# Altium schematic sheet blm_ctrl_processor.SchDoc
size A4; DrawnBy: mcattin; Organization: E-ROBOT
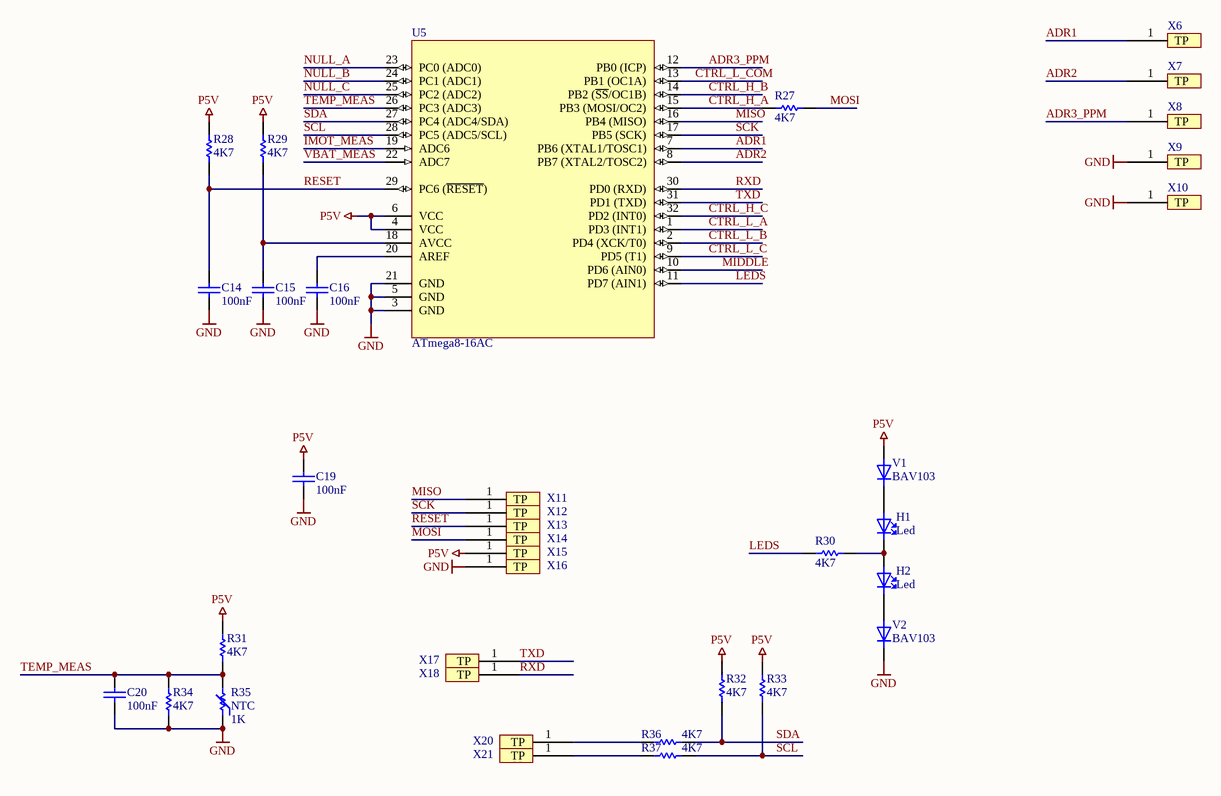
[diagram p0: blm_ctrl_processor.SchDoc]

## Parts
C14  value 100nF  [0603]  (hidden comment: Cap)
C15  value 100nF  [0603]  (hidden comment: Cap)
C16  value 100nF  [0603]  (hidden comment: Cap)
C19  value 100nF  [0603]  (hidden comment: Cap)
C20  value 100nF  [0603]  (hidden comment: Cap)
H1  Led  [0603_LED]
H2  Led  [0603_LED]
R27  value 4K7  [0603]  (hidden comment: Res1)
R28  value 4K7  [0603]  (hidden comment: Res1)
R29  value 4K7  [0603]  (hidden comment: Res1)
R30  value 4K7  [0603]  (hidden comment: Res1)
R31  value 4K7  [0603]  (hidden comment: Res1)
R32  value 4K7  [0603]  (hidden comment: Res1)
R33  value 4K7  [0603]  (hidden comment: Res1)
R34  value 4K7  [0603]  (hidden comment: Res1)
R35  NTC  value 1K  [0603]
R36  value 4K7  [0603]  (hidden comment: Res1)
R37  value 4K7  [0603]  (hidden comment: Res1)
U5  ATmega8-16AC  [32A_L]
V1  value BAV103  [0603_LED]  (hidden comment: Diode)
V2  value BAV103  [0603_LED]  (hidden comment: Diode)
X6  (no value)  [PAD_SMD_0.5x1MM]
X7  (no value)  [PAD_SMD_0.5x1MM]
X8  (no value)  [PAD_SMD_0.5x1MM]
X9  (no value)  [PAD_SMD_0.5x1MM]
X10  (no value)  [PAD_SMD_0.5x1MM]
X11  (no value)  [PAD_SMD_1.5x2.5MM]
X12  (no value)  [PAD_SMD_1.5x2.5MM]
X13  (no value)  [PAD_SMD_1.5x2.5MM]
X14  (no value)  [PAD_SMD_1.5x2.5MM]
X15  (no value)  [PAD_SMD_1.5x2.5MM]
X16  (no value)  [PAD_SMD_1.5x2.5MM]
X17  (no value)  [PAD_SMD_1x2MM]
X18  (no value)  [PAD_SMD_1x2MM]
X20  (no value)  [PAD_SMD_1x2MM]
X21  (no value)  [PAD_SMD_1x2MM]

## Nets
GND: C14.2 C15.2 C16.2 C19.2 C20.2 R34.2 R35.2 U5.3(GND) U5.5(GND) U5.21(GND) V2.2(CATHODE) X9.1(TP) X10.1(TP) X16.1(TP)
P5V: C19.1 R28.1 R29.1 R31.1 R32.1 R33.1 U5.4(VCC) U5.6(VCC) V1.1(ANODE) X15.1(TP)
ADR1: U5.7(PB6_(XTAL1/TOSC1)) X6.1(TP)
ADR2: U5.8(PB7_(XTAL2/TOSC2)) X7.1(TP)
ADR3_PPM: U5.12(PB0_(ICP)) X8.1(TP)
CTRL_H_A: R27.2 U5.15(PB3_(MOSI/OC2))
CTRL_H_B: U5.14(PB2_(~{SS}/OC1B))
CTRL_H_C: U5.32(PD2_(INT0))
CTRL_L_A: U5.1(PD3_(INT1))
CTRL_L_B: U5.2(PD4_(XCK/T0))
CTRL_L_C: U5.9(PD5_(T1))
CTRL_L_COM: U5.13(PB1_(OC1A))
IMOT_MEAS: U5.19(ADC6)
LEDS: R30.1 U5.11(PD7_(AIN1))
MIDDLE: U5.10(PD6_(AIN0))
MISO: U5.16(PB4_(MISO)) X11.1(TP)
MOSI: R27.1 X14.1(TP)
NULL_A: U5.23(PC0_(ADC0))
NULL_B: U5.24(PC1_(ADC1))
NULL_C: U5.25(PC2_(ADC2))
RESET: C14.1 R28.2 U5.29(PC6_(~{RESET})) X13.1(TP)
RXD: U5.30(PD0_(RXD)) X18.1(TP)
SCK: U5.17(PB5_(SCK)) X12.1(TP)
SCL: R33.2 R37.1 U5.28(PC5_(ADC5/SCL))
SDA: R32.2 R36.1 U5.27(PC4_(ADC4/SDA))
TEMP_MEAS: C20.1 R31.2 R34.1 R35.1 U5.26(PC3_(ADC3))
TXD: U5.31(PD1_(TXD)) X17.1(TP)
VBAT_MEAS: U5.22(ADC7)
NetC15_1: C15.1 R29.2 U5.18(AVCC)
NetC16_1: C16.1 U5.20(AREF)
NetH1_1: H1.1(ANODE) V1.2(CATHODE)
NetH1_2: H1.2(CATHODE) H2.1(ANODE) R30.2
NetH2_2: H2.2(CATHODE) V2.1(ANODE)
NetR36_2: R36.2 X20.1(TP)
NetR37_2: R37.2 X21.1(TP)

## Notes on the sheet
- Title
- Size:
- Date:
- A3
- Number:
- Time:
- Revision:
- Sheet
- of
- Design:
- File:

## Library data of the parts
C14-C16 C19 C20 = Cap: Capacitor; Published: 8-Jun-2000; LatestRevisionDate: 17-Jul-2002; LatestRevisionNote: Re-released for DXP Platform.; PackageReference: RAD-0.3; Publisher: Altium Limited
H1 H2 = Led: Led low current; Fournisseur: *; Ref_fournisseur: *
R27-R34 R36 R37 = Res1: Resistor; Published: 8-Jun-2000; LatestRevisionDate: 17-Jul-2002; LatestRevisionNote: Re-released for DXP Platform.; PackageReference: AXIAL-0.3; Publisher: Altium Limited
R35 = NTC: Temperature dependent resistor
U5 = ATmega8-16AC: 8-Bit AVR Microcontroller with 8K Bytes of In-System Programmable Flash Memory; Published: 17-Sep-2003; LatestRevisionDate: 13-Apr-2006; LatestRevisionNote: IPC-7351 Footprint Added.; DatasheetVersion: 2486H-AVR-09/02; PackageVersion: revB, Oct-2001; PackageReference: 32A; Publisher: Altium Limited; PackageDescription: 32-Pin Thin Quad Flat Pack 0.8 mm Pitch; Code_JEDEC: MS-026-ABA; ComponentLink1Description: Manufacturer Link; ComponentLink1URL: http://www.atmel.com; ComponentLink2Description: Datasheet; ComponentLink2URL: http://www.atmel.com/dyn/resources/prod_documents/doc2486.pdf
X6-X18 X20 X21 = TEST_POINT
V1 V2 = Diode: Fournisseur: *; Ref_fournisseur: *